# EasyEDA schematic SCH_KTH7823编码器板V1.0.json
TITLE: KTH7823编码器板V1.0; REV: 1.0; Date: 2025-08-13; Sheet: 1/1; Drawn By: 嵌入式软件工程师YHR; Company: Your Company
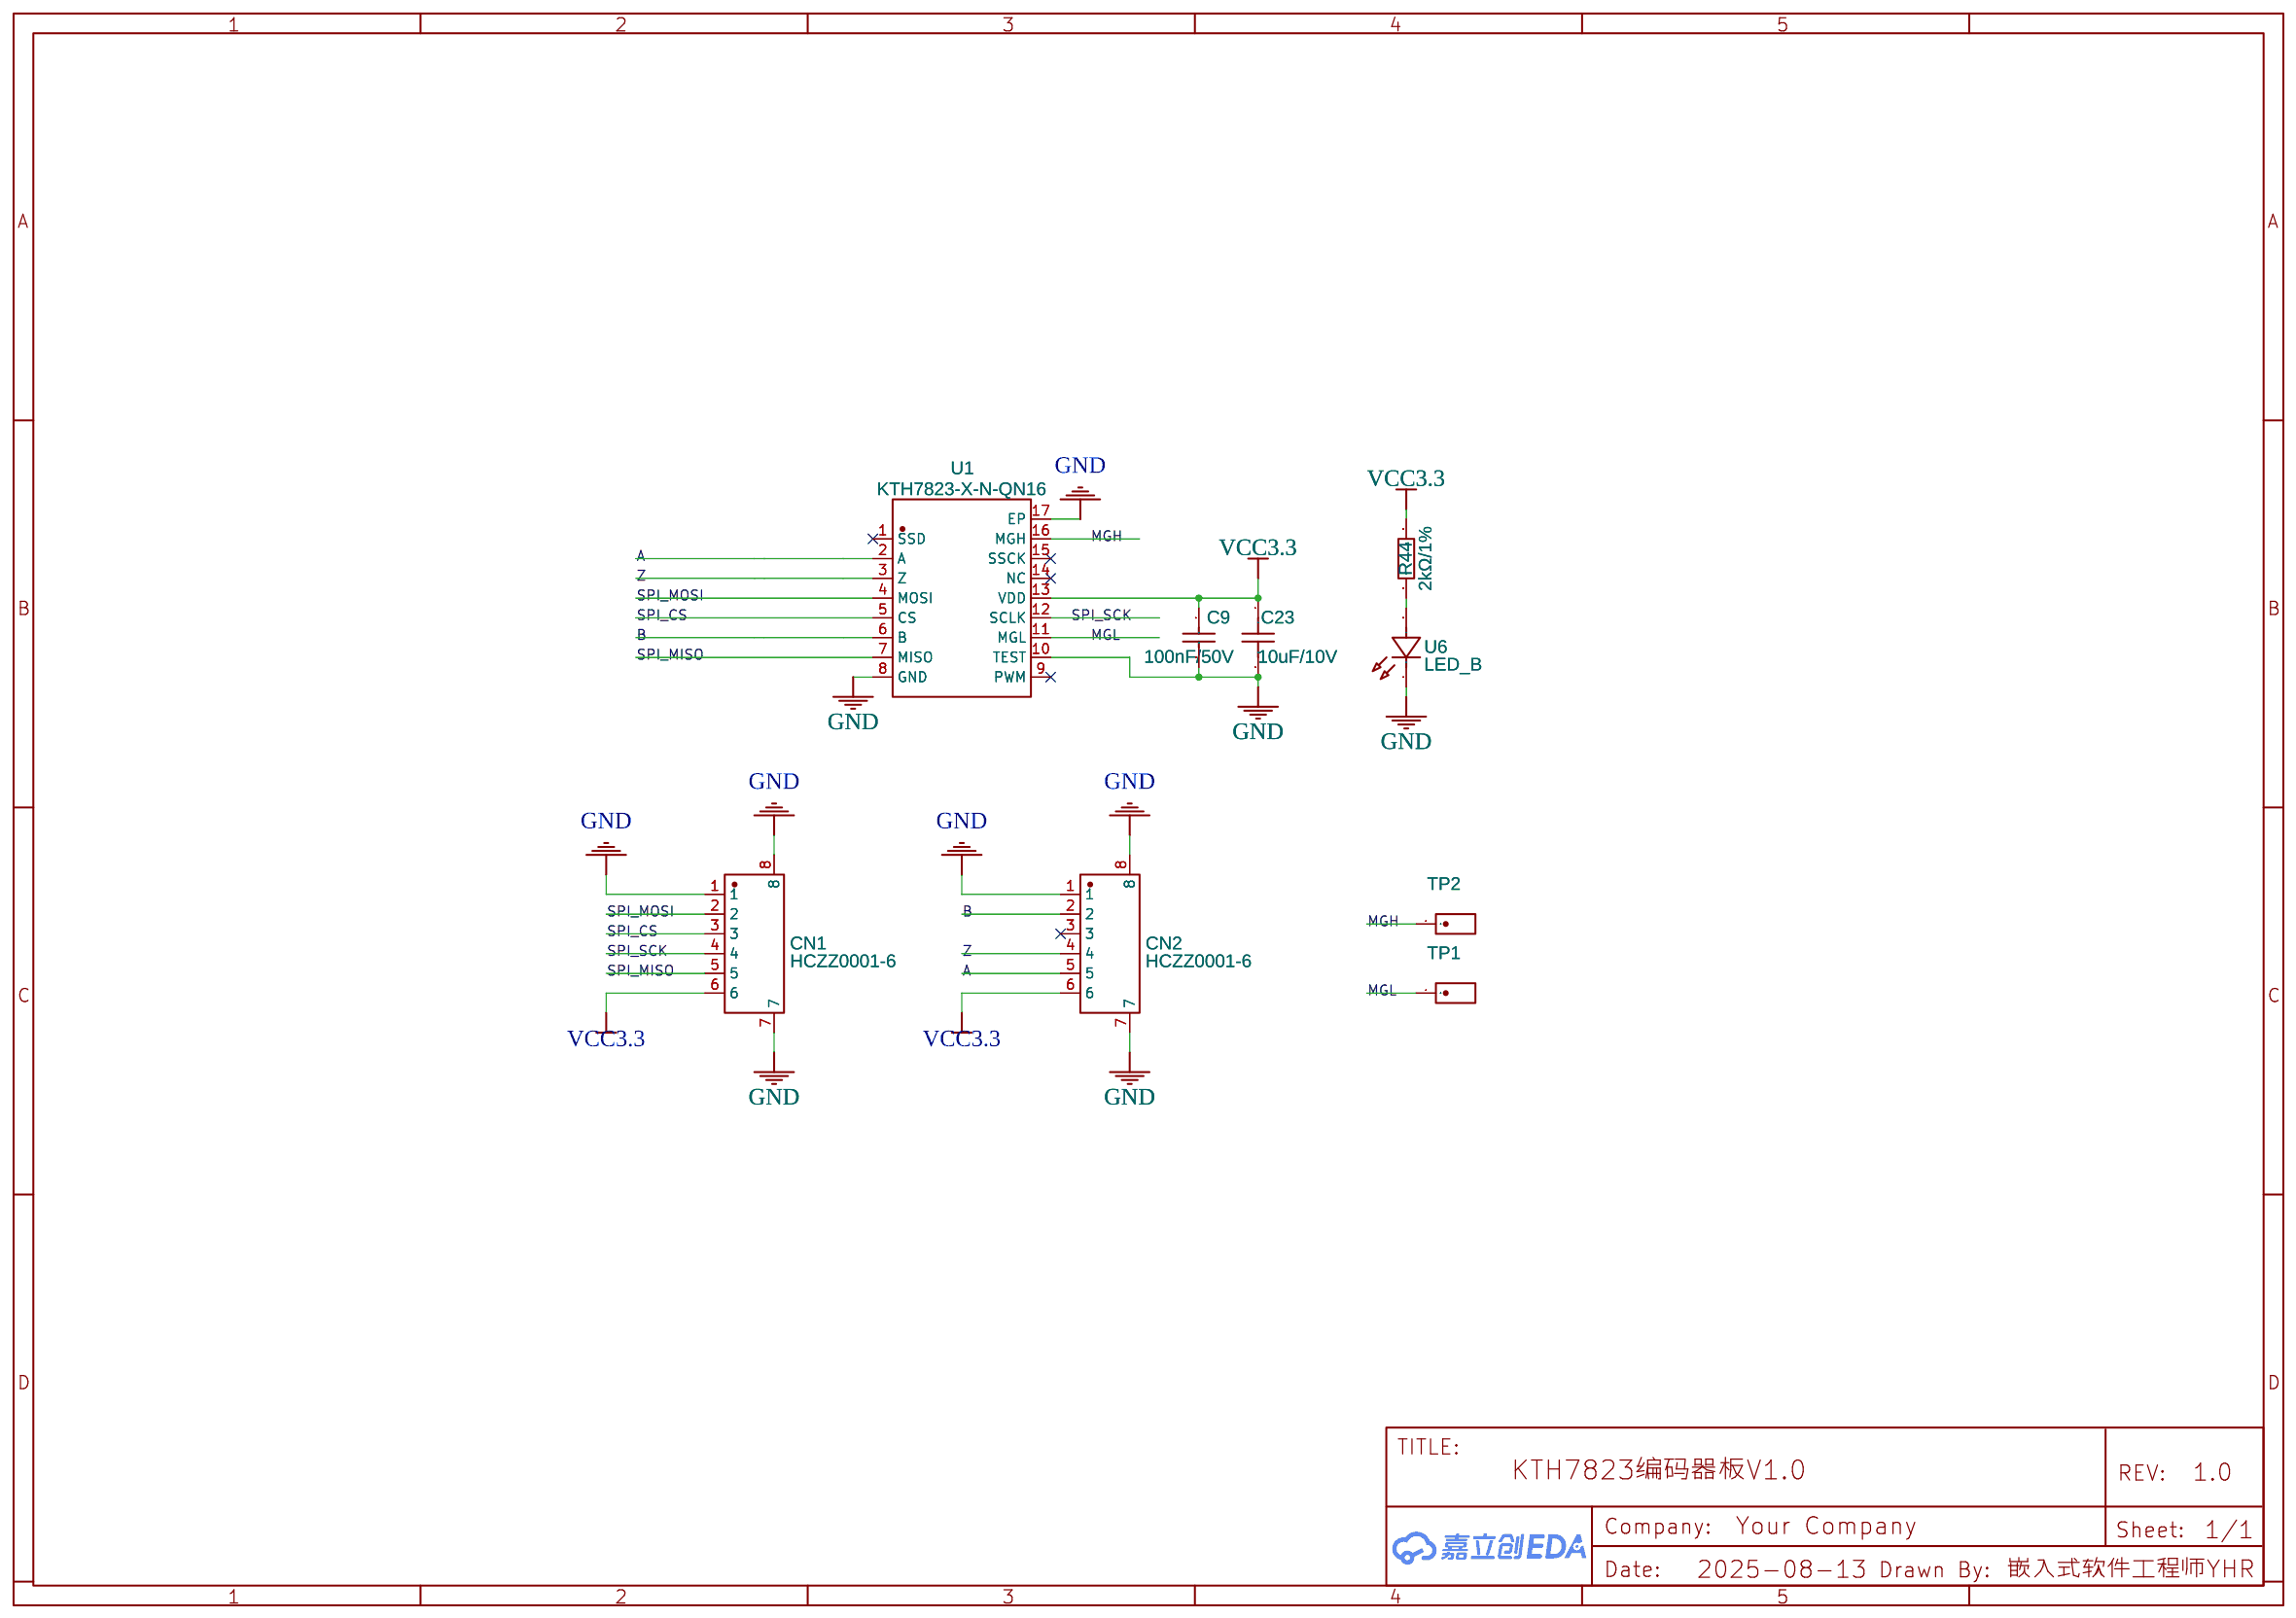
[diagram p0: schematic sheet]

## Parts
C9  100nF/50V  [MY_0402]
C23  10uF/10V  [MY_0402]
CN1  HCZZ0001-6  [CONN-SMD_6P-P1.25_HCZZ0001-6]
CN2  HCZZ0001-6  [CONN-SMD_6P-P1.25_HCZZ0001-6]
R44  2kΩ/1%  [MY_0402]
TP1  5V  [测试点]
TP2  5V  [测试点]
U1  KTH7823-X-N-QN16  [QFN-16_L3.0-W3.0-P0.50-TL-EP]
U6  LED_B  [LED0402-RD]

## Library data of the parts
C9 = CC0402KRX7R9BB104: Contributor: LCSC; Supplier: LCSC; Supplier Part: C131394; Manufacturer: YAGEO(国巨); JLCPCB Part Class: Extended Part
C23 = CL05A106MP5NUNC_C315248: Contributor: LCSC; Supplier: LCSC; Supplier Part: C315248; Manufacturer: SAMSUNG(三星); Manufacturer Part: CL05A106MP5NUNC; JLCPCB Part Class: Extended Part
CN1 CN2 = HCZZ0001-6: Supplier: LCSC; Supplier Part: C7433457; Manufacturer: HC(虹成电子); JLCPCB Part Class: Extended Part; Contributor: lcsc
R44 = RC0402FR-072KL: Supplier: LCSC; Manufacturer: YAGEO(国巨); Supplier Part: C60488; JLCPCB Part Class: Extended Part
TP1 TP2 = 测试点: Contributor: fslwcndyd
U1 = KTH7823-X-N-QN16: Supplier: LCSC; Supplier Part: C20623409; Manufacturer: CONNTEK(昆泰芯); JLCPCB Part Class: Extended Part; Contributor: lcsc
U6 = XL-1005UBC_C22355736: Supplier: LCSC; Supplier Part: C22355736; Manufacturer: XINGLIGHT(成兴光); Manufacturer Part: XL-1005UBC; JLCPCB Part Class: Extended Part; Contributor: lcsc

## Nets
GND: C9.2 C23.2 CN1.1 CN1.7 CN1.8 CN2.1 CN2.7 CN2.8 U1.8(GND) U1.10(TEST) U1.17(EP) U6.1(K)
VCC3.3: C9.1 C23.1 CN1.6 CN2.6 R44.2 U1.13(VDD)
A: CN2.5 U1.2(A)
B: CN2.2 U1.6(B)
MGH: TP2.1 U1.16(MGH)
MGL: TP1.1 U1.11(MGL)
SPI_CS: CN1.3 U1.5(CS)
SPI_MISO: CN1.5 U1.7(MISO)
SPI_MOSI: CN1.2 U1.4(MOSI)
SPI_SCK: CN1.4 U1.12(SCLK)
Z: CN2.4 U1.3(Z)
Net-(R44-1): R44.1 U6.2(A)

Not connected (* = marked no-connect by the designer): CN2 3*; U1 1(SSD)* 9(PWM)* 14(NC)* 15(SSCK)*
